# Altium schematic sheet SOCConfiguration.SchDoc
size A4; SheetNumber: 7; SheetTotal: 18
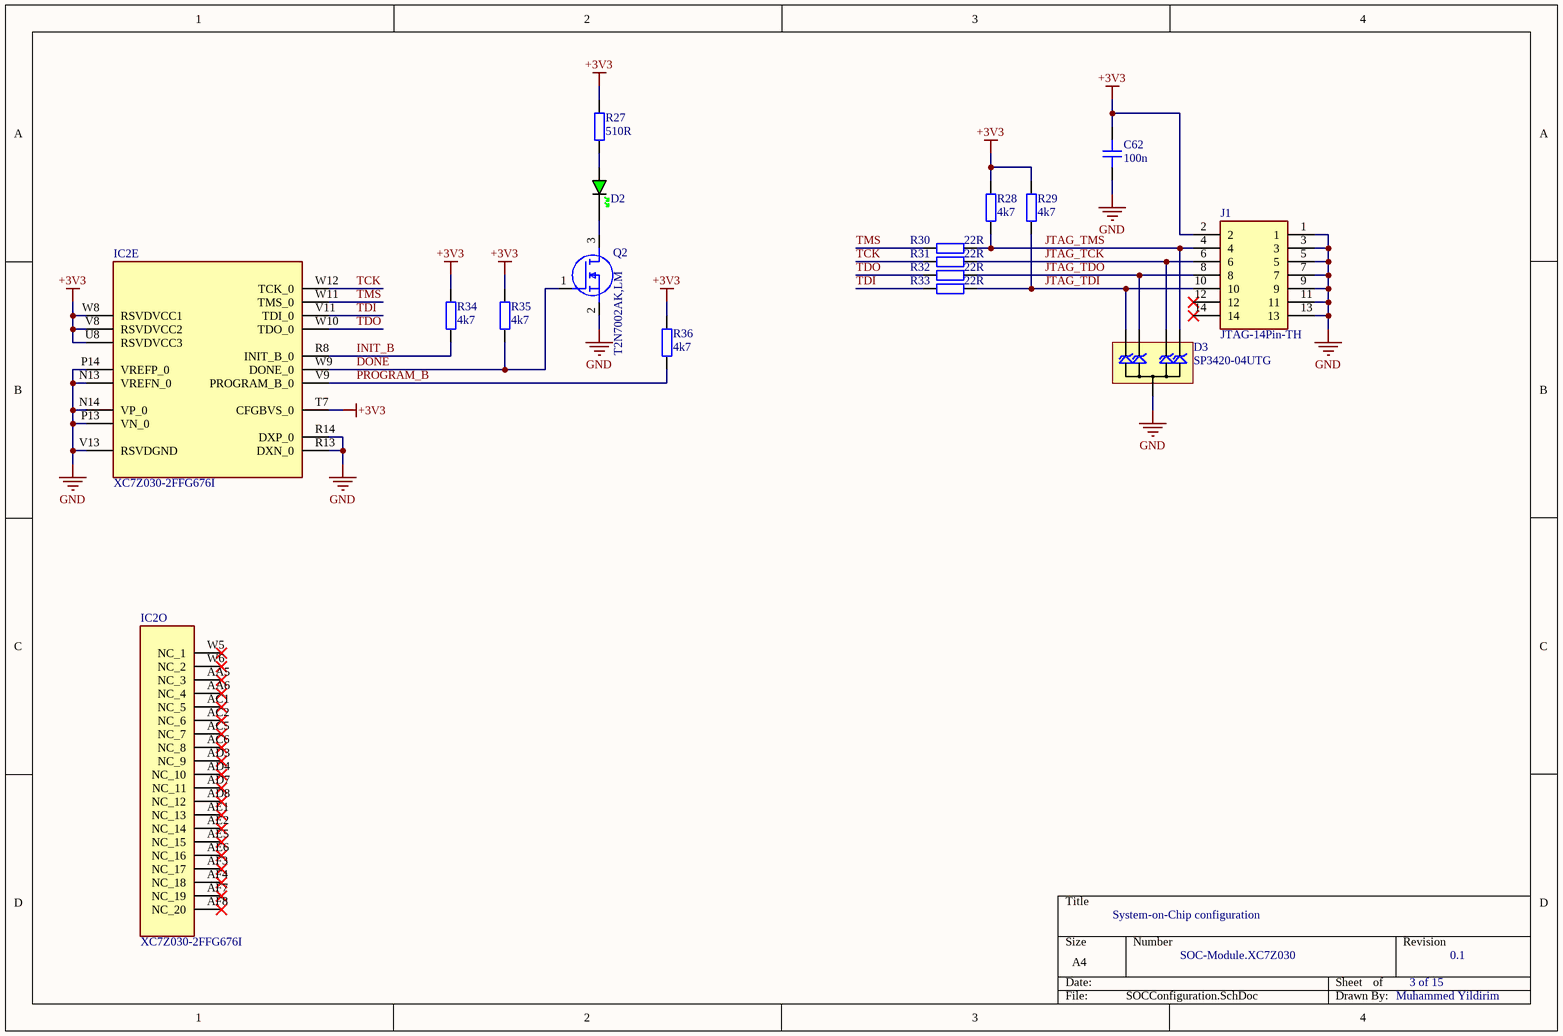
[diagram p0: SOCConfiguration.SchDoc]

## Parts
C62  100n  [CAP_0402]
D2  GREEN  [LED_0603_GREEN]  (value not drawn)
D3  SP3420-04UTG  [uDFN-10]
IC2  XC7Z030-2FFG676I  [BGA676C100P26X26_2700X2700X324]  (parts E,O of 15)
J1  JTAG-14Pin-TH  [14Pin-TH]
Q2  T2N7002AK,LM  [TBAT54CLM]
R27  510R  [RES_0603]
R28  4k7  [RES_0201]
R29  4k7  [RES_0201]
R30  22R  [RES_0201]
R31  22R  [RES_0201]
R32  22R  [RES_0201]
R33  22R  [RES_0201]
R34  4k7  [RES_0201]
R35  4k7  [RES_0201]
R36  4k7  [RES_0201]

## Nets
+3V3: C62.2 IC2.T7(CFGBVS_0) IC2.U8(RSVDVCC3) IC2.V8(RSVDVCC2) IC2.W8(RSVDVCC1) J1.2 R27.2 R28.2 R29.2 R34.2 R35.2 R36.2
GND: C62.1 D3.38(GND) IC2.N13(VREFN_0) IC2.N14(VP_0) IC2.P13(VN_0) IC2.P14(VREFP_0) IC2.R13(DXN_0) IC2.R14(DXP_0) IC2.V13(RSVDGND) J1.1 J1.3 J1.5 J1.7 J1.9 J1.11 J1.13 Q2.2(S)
DONE: IC2.W9(DONE_0) Q2.1(G) R35.1
INIT_B: IC2.R8(INIT_B_0) R34.1
JTAG_TCK: D3.47 J1.6 R31.1
JTAG_TDI: D3.110 J1.10 R29.1 R33.1
JTAG_TDO: D3.29 J1.8 R32.1
JTAG_TMS: D3.56 J1.4 R28.1 R30.1
PROGRAM_B: IC2.V9(PROGRAM_B_0) R36.1
TCK: IC2.W12(TCK_0) R31.2
TDI: IC2.V11(TDI_0) R33.2
TDO: IC2.W10(TDO_0) R32.2
TMS: IC2.W11(TMS_0) R30.2
NetD2_A: D2.A R27.1
NetD2_K: D2.K Q2.3(D)

Not connected (* = marked no-connect by the designer): IC2 AA5(NC_3)* AA6(NC_4)* AC1(NC_5)* AC2(NC_6)* AC5(NC_7)* AC6(NC_8)* AD3(NC_9)* AD4(NC_10)* AD7(NC_11)* AD8(NC_12)* AE1(NC_13)* AE2(NC_14)* AE5(NC_15)* AE6(NC_16)* AF3(NC_17)* AF4(NC_18)* AF7(NC_19)* AF8(NC_20)* W5(NC_1)* W6(NC_2)*; J1 12* 14*

## Notes on the sheet
- System-on-Chip configuration
- SOC-Module.XC7Z030
- 3 of 15
- 0.1
- Muhammed Yildirim

## Library data of the parts
C62 = CAP_0402: Capacitor SMD 0402; Manufacturer: *; Manufacturer Part Number: *; Distributor Link: *; LCSC: *; Rating: *; Dielectric: *
D2 = LED_0603_GREEN: LED 0603 GREEN SMD
D3 = SP3420-04UTG: TVS Diode Array Low Capacitance ESD Protection 4-Channel (Vwork=3V3, Vclamp=6V); Manufacturer: Littelfuse; Manufacturer Part Number: SP3420-04UTG
IC2 = XC7Z030-2FFG676I: Integrated Circuit; Manufacturer_Name: AMD; Datasheet Link: http://www.xilinx.com/support/documentation/data_sheets/ds190-Zynq-7000-Overview.pdf; Height: 3.24mm; Manufacturer_Part_Number: XC7Z030-2FFG676I; Mouser Part Number: 217-XC7Z030-2FFG676I; Mouser Price/Stock: https://www.mouser.co.uk/ProductDetail/Xilinx/XC7Z030-2FFG676I?qs=rrS6PyfT74cuZK5O3CSpmw%3D%3D
J1 = JTAG-14Pin-TH: Connector; Manufacturer_Name: Molex; Manufacturer_Part_Number: 87832-1416; Datasheet Link: http://uk.rs-online.com/web/p/products/6701077; Height: 7.6mm; Mouser Part Number: 538-87832-1416; Mouser Price/Stock: https://www.mouser.co.uk/ProductDetail/Molex/87832-1416?qs=kNSQ05%252BLZoDeXuSWsnDgxQ%3D%3D
Q2 = T2N7002AK,LM: MOSFET (N-Channel); Manufacturer_Name: Toshiba; Datasheet Link: http://toshiba.semicon-storage.com/info/docget.jsp?did=29712&prodName=T2N7002AK; Height: 1.1mm; Manufacturer_Part_Number: T2N7002AK,LM; Mouser Part Number: 757-T2N7002AKLM; Mouser Price/Stock: https://www.mouser.co.uk/ProductDetail/Toshiba/T2N7002AKLM?qs=pzVvXTvk9PzfX4hYglwZ9Q%3D%3D; Arrow Part Number: T2N7002AK,LM; Arrow Price/Stock: https://www.arrow.com/en/products/t2n7002aklm/toshiba?region=nac
R27 = RES_0603: Resistor SMD 0603; Manufacturer: *; Manufacturer Part Number: *; Distributor Link: *; LCSC: *
R28-R36 = RES_0201: Resistor SMD 0201; Manufacturer: *; Manufacturer Part Number: *; Distributor Link: *; LCSC: *